# EAGLE schematic lightSource (EAGLE 9.1.2)

## Sheet 1 of 3
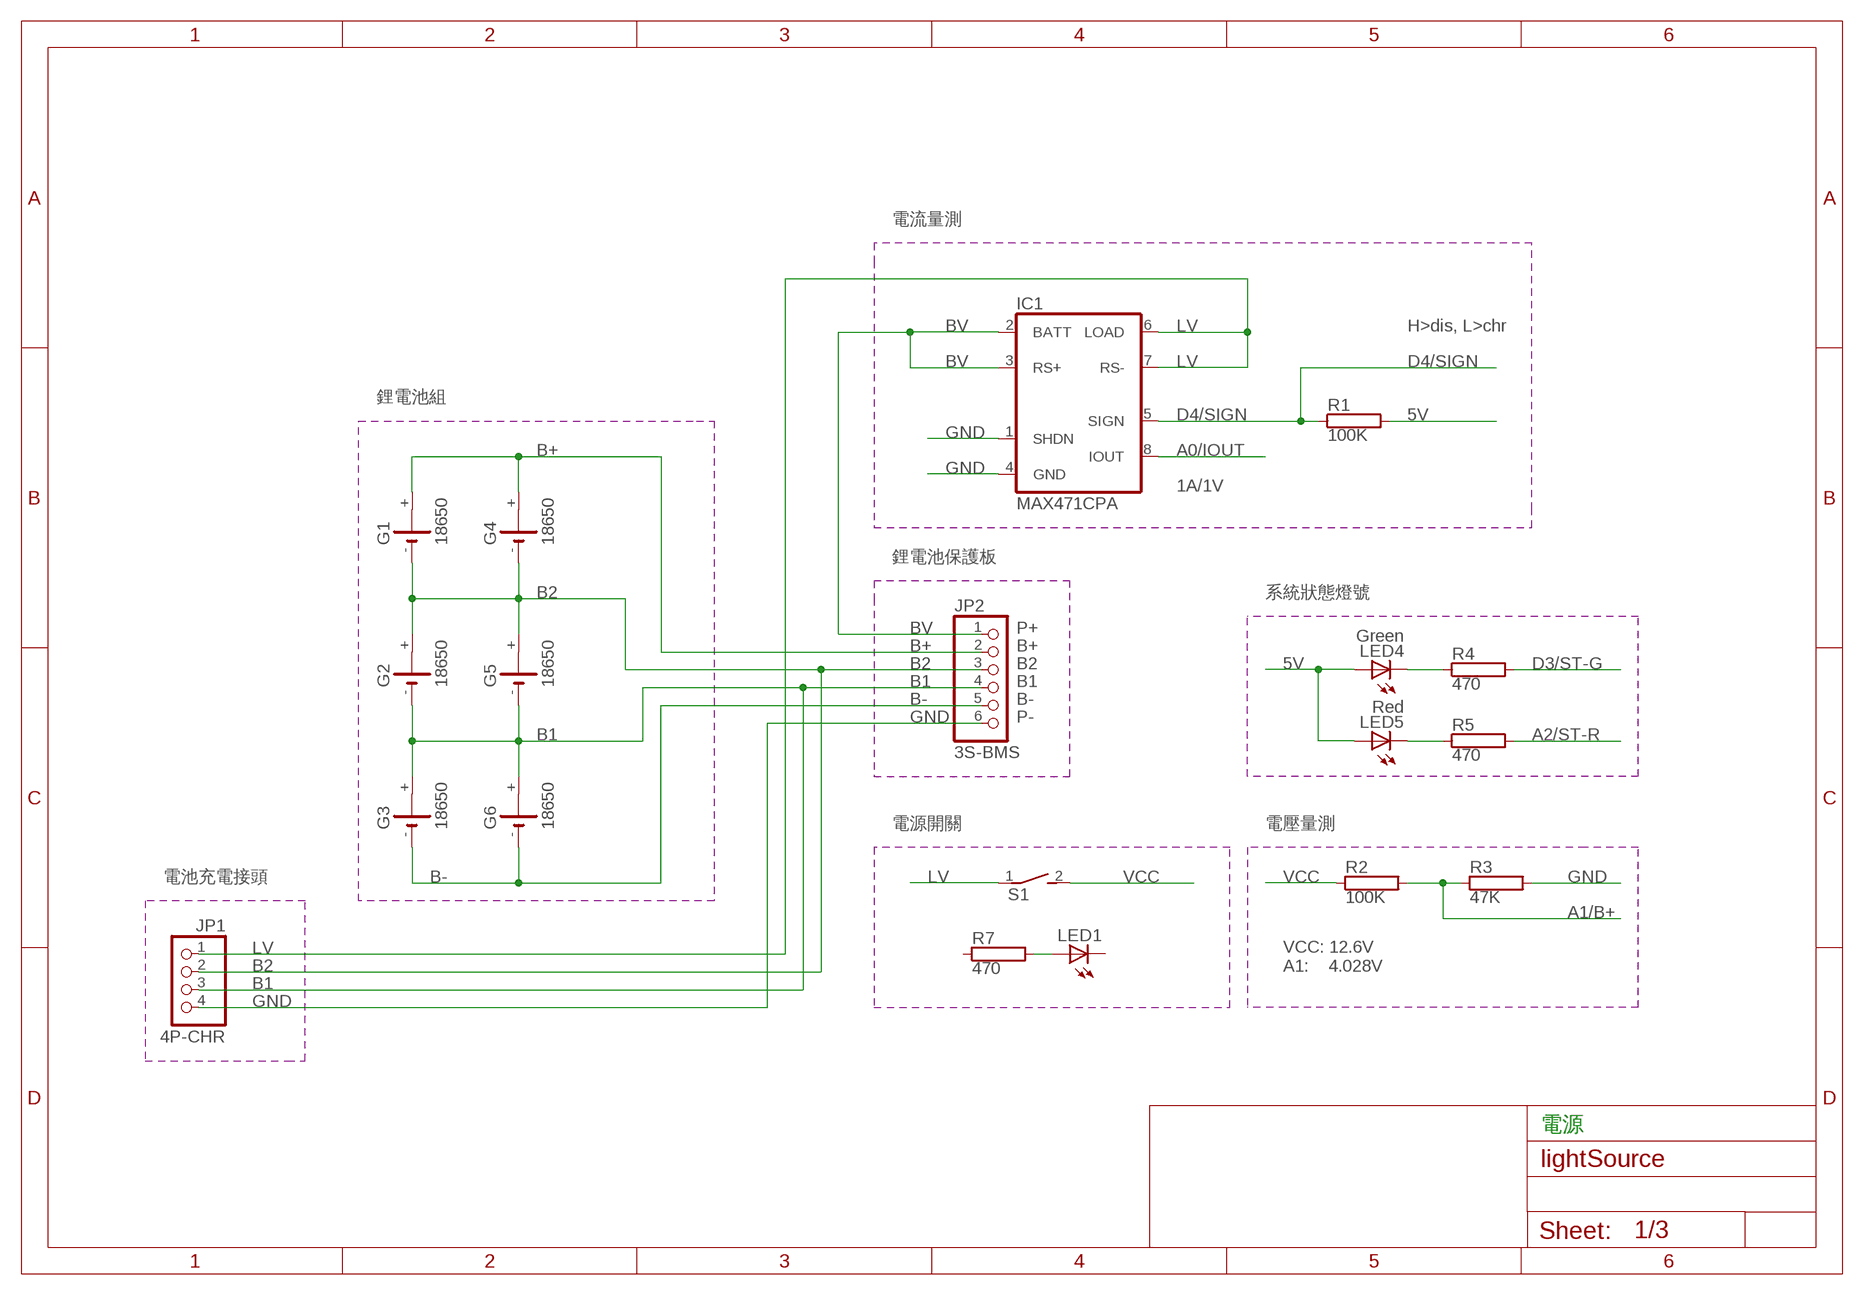
[diagram p0: schematic, sheet 1]

### Parts
G1  18650  CRAA  [CRAA]
G2  18650  CRAA  [CRAA]
G3  18650  CRAA  [CRAA]
G4  18650  CRAA  [CRAA]
G5  18650  CRAA  [CRAA]
G6  18650  CRAA  [CRAA]
IC1  MAX471CPA  [DIL08]
JP1  4P-CHR  PINHD-1X4  [1X04]
JP2  3S-BMS  PINHD-1X6  [1X06]
LED1  LED5MM  [LED5MM]
LED4  Green  LED5MM  [LED5MM]
LED5  Red  LED5MM  [LED5MM]
R1  100K  RRS1/4  [RS1/4]
R2  100K  RRS1/4  [RS1/4]
R3  47K  RRS1/4  [RS1/4]
R4  470  RRS1/4  [RS1/4]
R5  470  RRS1/4  [RS1/4]
R7  470  RRS1/4  [RS1/4]
S1  DS01E  [DS-01]

### Nets
5V: LED4.A LED5.A R1.2 ; also sheet 2
A0/IOUT: IC1.8(IOUT) ; also sheet 2
A1/B+: R2.2 R3.1 ; also sheet 2
A2/ST-R: R5.2 ; also sheet 2
B1: G2.- G3.+ G5.- G6.+ JP1.3 JP2.4
B2: G1.- G2.+ G4.- G5.+ JP1.2 JP2.3
B+: G1.+ G4.+ JP2.2
B-: G3.- G6.- JP2.5
BV: IC1.2(BATT) IC1.3(RS+) JP2.1
D3/ST-G: R4.2 ; also sheet 2
D4/SIGN: IC1.5(SIGN) R1.1 ; also sheet 2
GND: IC1.1(SHDN) IC1.4(GND) JP1.4 JP2.6 R3.2 ; also sheet 2,3
LV: IC1.6(LOAD) IC1.7(RS-) JP1.1 S1.1
N$1: LED1.A R7.2
N$5: LED4.K(C) R4.1
N$6: LED5.K(C) R5.1
VCC: R2.1 S1.2 ; also sheet 2,3
Unconnected: G1.+@1(+) G2.+@1(+) G3.+@1(+) G4.+@1(+) G5.+@1(+) G6.+@1(+) LED1.K(C) R7.1

### Notes on the sheet
- 電流量測
- H>dis, L>chr
- 鋰電池組
- 1A/1V
- 鋰電池保護板
- 系統狀態燈號
- P+
- B+
- B2
- B1
- B-
- P-
- 電源開關 | 電壓量測
- 電池充電接頭
- VCC: 12.6V
  A1:    4.028V
- 電源

## Sheet 2 of 3
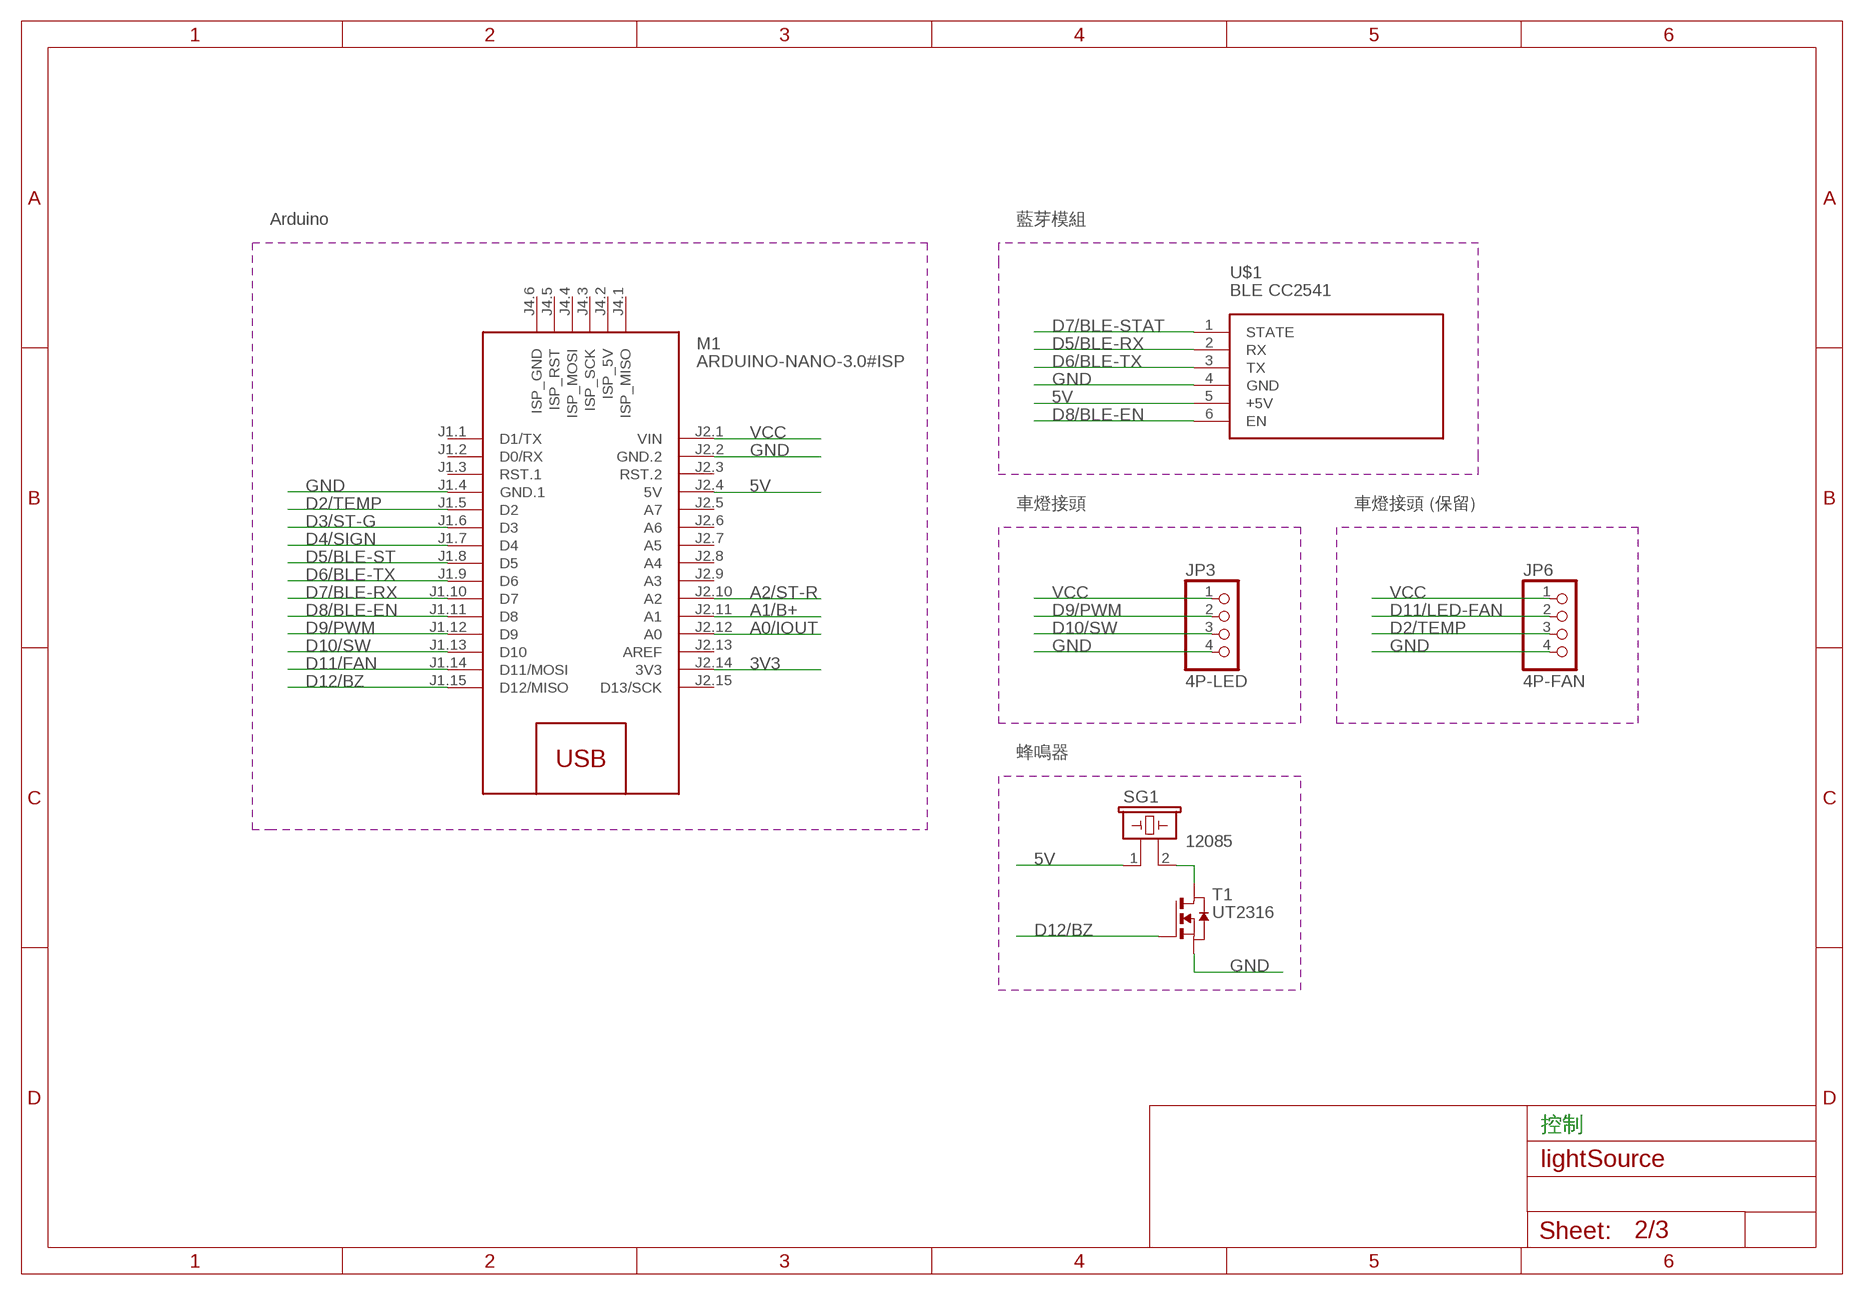
[diagram p1: schematic, sheet 2]

### Parts
JP3  4P-LED  PINHD-1X4  [1X04]
JP6  4P-FAN  PINHD-1X4  [1X04]
M1  ARDUINO-NANO-3.0#ISP  [ARDUINO-NANO-3.0#ISP]
SG1  12085  B/C11S  [B/C11S]
T1  UT2316  NMOSSOT23  [SOT-23]
U$1  BLE CC2541  WIRELESS-BLUETOOTH-HC-05  [WIRELESS-BLUETOOTH-HC-05]

### Nets
3V3: M1.J2.14(3V3)
5V: M1.J2.4(5V) SG1.1 U$1.5(+5V) ; also sheet 1
A0/IOUT: M1.J2.12(A0) ; also sheet 1
A1/B+: M1.J2.11(A1) ; also sheet 1
A2/ST-R: M1.J2.10(A2) ; also sheet 1
D2/TEMP: JP6.3 M1.J1.5(D2)
D3/ST-G: M1.J1.6(D3) ; also sheet 1
D4/SIGN: M1.J1.7(D4) ; also sheet 1
D5/BLE-RX: U$1.2(RX)
D5/BLE-ST: M1.J1.8(D5)
D6/BLE-TX: M1.J1.9(D6) U$1.3(TX)
D7/BLE-RX: M1.J1.10(D7)
D7/BLE-STAT: U$1.1(STATE)
D8/BLE-EN: M1.J1.11(D8) U$1.6(EN)
D9/PWM: JP3.2 M1.J1.12(D9) ; also sheet 3
D10/SW: JP3.3 M1.J1.13(D10) ; also sheet 3
D11/FAN: M1.J1.14(D11/MOSI)
D11/LED-FAN: JP6.2
D12/BZ: M1.J1.15(D12/MISO) T1.3(G)
GND: JP3.4 JP6.4 M1.J1.4(GND.1) M1.J2.2(GND.2) T1.2(S) U$1.4(GND) ; also sheet 1,3
N$4: SG1.2 T1.1(D)
VCC: JP3.1 JP6.1 M1.J2.1(VIN) ; also sheet 1,3
Unconnected: M1.J1.1(D1/TX) M1.J1.2(D0/RX) M1.J1.3(RST.1) M1.J2.3(RST.2) M1.J2.5(A7) M1.J2.6(A6) M1.J2.7(A5) M1.J2.8(A4) M1.J2.9(A3) M1.J2.13(AREF) M1.J2.15(D13/SCK) M1.J4.1(ISP_MISO) M1.J4.2(ISP_5V) M1.J4.3(ISP_SCK) M1.J4.4(ISP_MOSI) M1.J4.5(ISP_RST) M1.J4.6(ISP_GND)

### Notes on the sheet
- Arduino | 藍芽模組
- 車燈接頭 | 車燈接頭 (保留)
- 蜂鳴器
- 控制

## Sheet 3 of 3
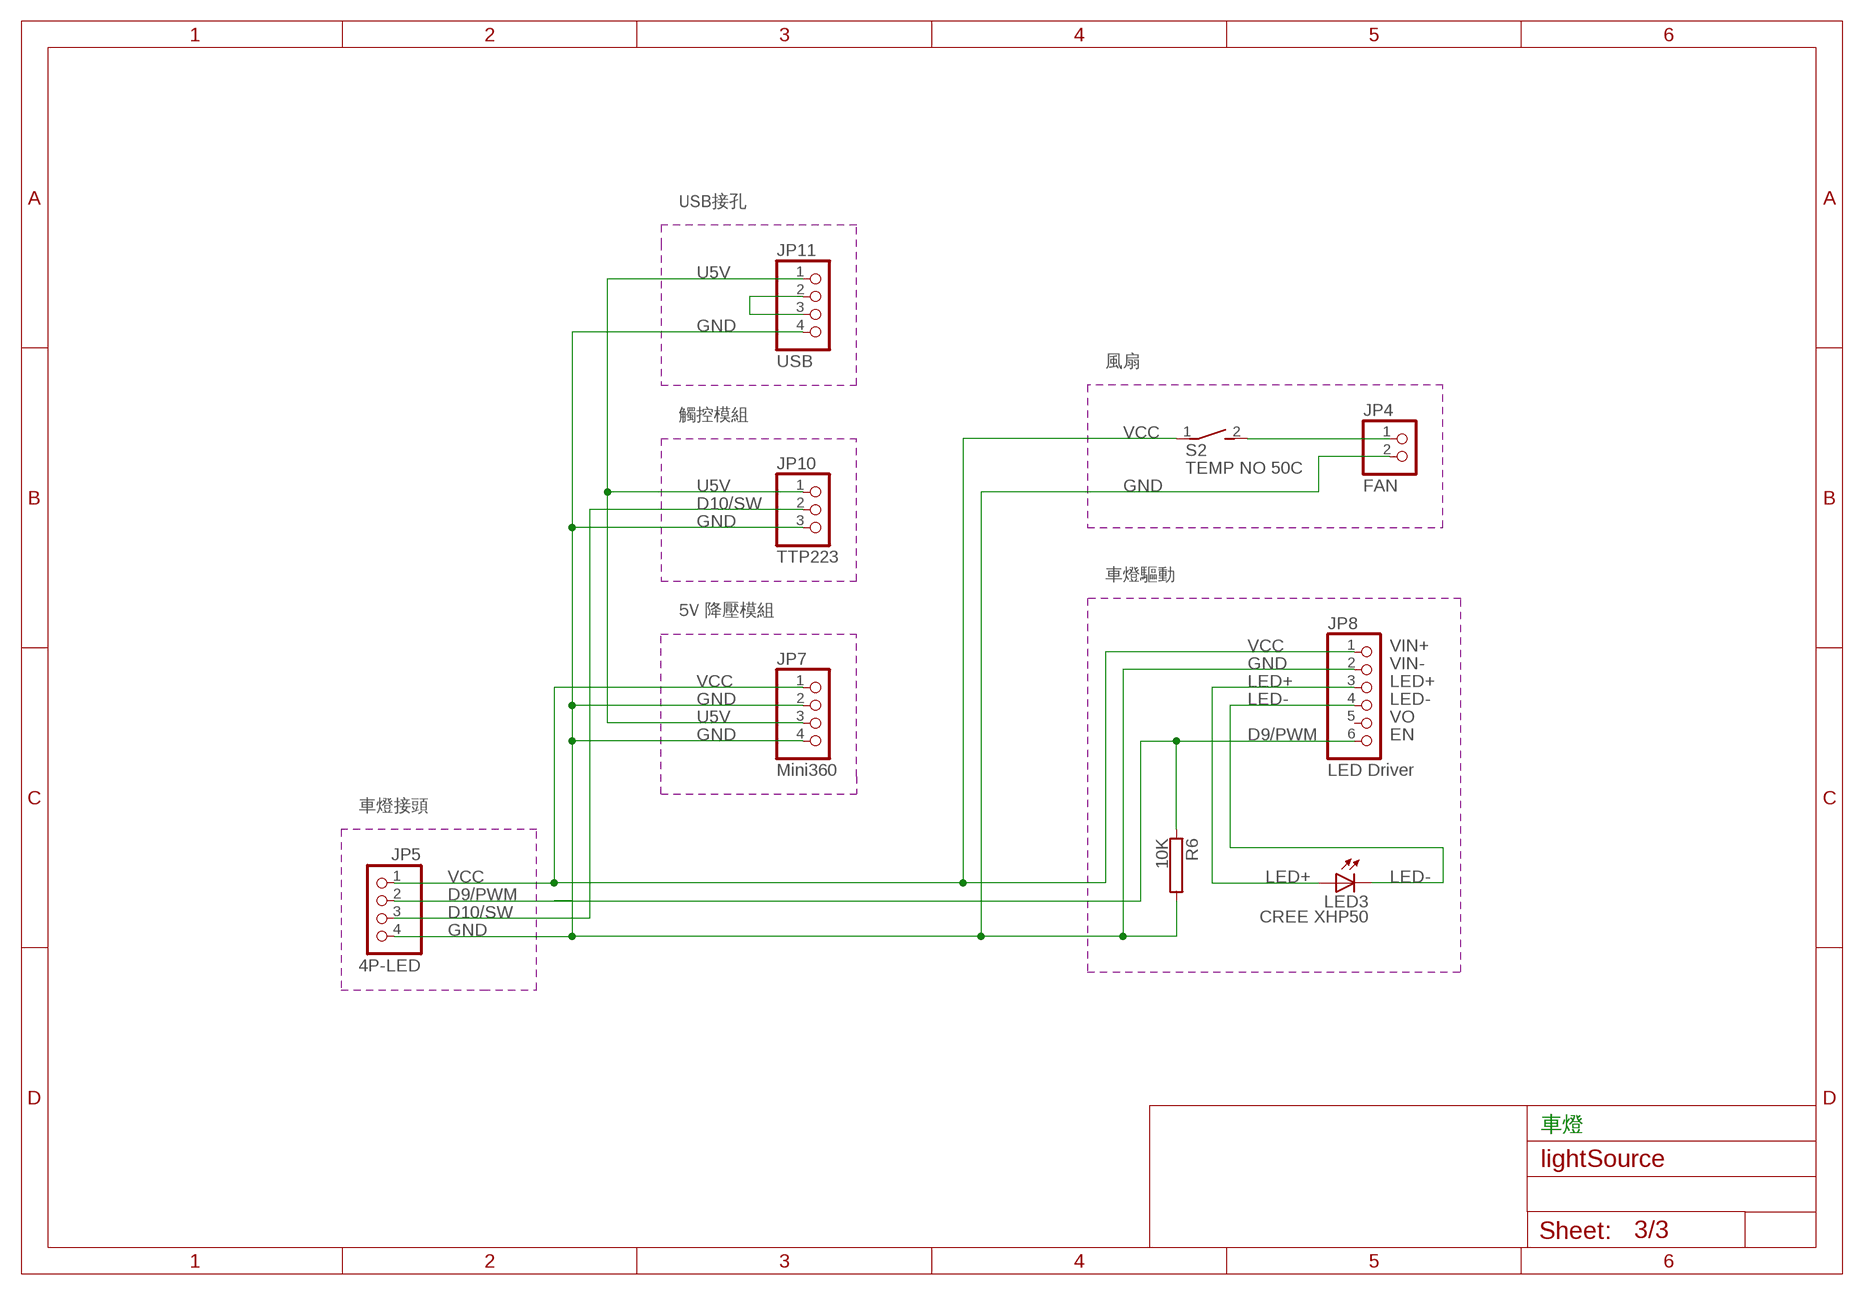
[diagram p2: schematic, sheet 3]

### Parts
JP4  FAN  PINHD-1X2  [1X02]
JP5  4P-LED  PINHD-1X4  [1X04]
JP7  Mini360  PINHD-1X4  [1X04]
JP8  LED Driver  PINHD-1X6  [1X06]
JP10  TTP223  PINHD-1X3  [1X03]
JP11  USB  PINHD-1X4  [1X04]
LED3  CREE XHP50  LED5MM  [LED5MM]
R6  10K  RRS1/4  [RS1/4]
S2  TEMP NO 50C  DS01E  [DS-01]

### Nets
D9/PWM: JP5.2 JP8.6 R6.1 ; also sheet 2
D10/SW: JP5.3 JP10.2 ; also sheet 2
GND: JP4.2 JP5.4 JP7.2 JP7.4 JP8.2 JP10.3 JP11.4 R6.2 ; also sheet 1,2
LED+: JP8.3 LED3.A
LED-: JP8.4 LED3.K(C)
N$2: JP11.2 JP11.3
N$3: JP4.1 S2.2
U5V: JP7.3 JP10.1 JP11.1
VCC: JP5.1 JP7.1 JP8.1 S2.1 ; also sheet 1,2
Unconnected: JP8.5

### Notes on the sheet
- USB接孔
- 風扇
- 觸控模組
- 車燈驅動
- 5V 降壓模組
- VIN+
- VIN-
- LED+
- LED-
- VO
- EN
- 車燈接頭
- 車燈

## Library data of the parts
G1-G6 = battery:CRAA: LI BATTERY Varta
IC1 = maxim:MAX471CPA: OP AMP
JP1 JP3 JP5-JP7 JP11 = pinhead:PINHD-1X4: PIN HEADER
JP2 JP8 = pinhead:PINHD-1X6: PIN HEADER
JP4 = pinhead:PINHD-1X2: PIN HEADER
JP10 = pinhead:PINHD-1X3: PIN HEADER
LED1 LED3-LED5 = led:LED: LED OSRAM: - CHIPLED LG R971, LG N971, LY N971, LG Q971, LY Q971, LO R971, LY R971 LH N974, LH R974 LS Q976, LO Q976, LY Q976 LO Q996 - Hyper CHIPLED LW Q18S LB Q993, LB Q99A, LB R99A - SideLED LS A670, LO A670, LY A670, LG A670, LP A670 LB A673, LV A673, LT A673, LW A673 LH A674 LY A675 LS A676, LA A676, LO A676, LY A676, LW A676 LS A679, LY A679, LG A679 - Hyper Micro SIDELED® LS Y876, LA Y876, LO Y876, LY Y876 LT Y87S - SmartLED LW L88C, LW L88S LB L89C, LB L89S, LG L890 LS L89K, LO L89K, LY L89K LS L896, LA L896, LO L896, LY L896 - TOPLED LS T670, LO T670, LY T670, LG T670, LP T670 LSG T670, LSP T670, LSY T670, LOP T670, LYG T670 LG T671, LOG T671, LSG T671 LB T673, LV T673, LT T673, LW T673 LH T674 LS T676, LA T676, LO T676, LY T676, LB T676, LH T676, LSB T676, LW T676 LB T67C, LV T67C, LT T67C, LS T67K, LO T67K, LY T67K, LW E67C LS E67B, LA E67B, LO E67B, LY E67B, LB E67C, LV E67C, LT E67C LW T67C LS T679, LY T679, LG T679 LS T770, LO T770, LY T770, LG T770, LP T770 LB T773, LV T773, LT T773, LW T773 LH T774 LS E675, LA E675, LY E675, LS T675 LS T776, LA T776, LO T776, LY T776, LB T776 LHGB T686 LT T68C, LB T68C - Hyper Mini TOPLED® LB M676 - Mini TOPLED Santana® LG M470 LS M47K, LO M47K, LY M47K Source: http://www.osram.convergy.de LUXEON: - LUMILED® LXK2-PW12-R00, LXK2-PW12-S00, LXK2-PW14-U00, LXK2-PW14-V00 LXK2-PM12-R00, LXK2-PM12-S00, LXK2-PM14-U00 LXK2-PE12-Q00, LXK2-PE12-R00, LXK2-PE12-S00, LXK2-PE14-T00, LXK2-PE14-U00 LXK2-PB12-K00, LXK2-PB12-L00, LXK2-PB12-M00, LXK2-PB14-N00, LXK2-PB14-P00, LXK2-PB14-Q00 LXK2-PR12-L00, LXK2-PR12-M00, LXK2-PR14-Q00, LXK2-PR14-R00 LXK2-PD12-Q00, LXK2-PD12-R00, LXK2-PD12-S00 LXK2-PH12-R00, LXK2-PH12-S00 LXK2-PL12-P00, LXK2-PL12-Q00, LXK2-PL12-R00 Source: www.luxeon.com KINGBRIGHT: KA-3528ASYC Source: www.kingbright.com
M1 = diy-modules:ARDUINO-NANO-3.0#ISP: Arduino Nano 3.0 (and compatible devices) with ISP pads More details available here: https://www.arduino.cc/en/Main/ArduinoBoardNano Click here to find device on ebay.com <http://www.ebay.com/sch/arduino+nano>
R1-R7 = resistor-power:R: Power Resitor; MF: OHMITE; MPN: RRS1K0; OC_FARNELL: unknown; OC_NEWARK: 01F7661
S1 S2 = switch-dil:DS01E: DIL/CODE SWITCH; OC_FARNELL: unknown; OC_NEWARK: unknown
SG1 = buzzer:B/C11S: BUZZER Source: Buerklin; OC_FARNELL: unknown; OC_NEWARK: unknown
T1 = zetex:NMOSSOT23: MOS FET; OC_FARNELL: unknown; OC_NEWARK: unknown
U$1 = diy-modules:WIRELESS-BLUETOOTH-HC-05: Bluetooth Transceiver Module based on HC-05 board Tutorial is available here: https://arduino-info.wikispaces.com/BlueTooth-HC05-HC06-Modules-How-To Click here to find device on ebay.com <http://www.ebay.com/sch/hc-05+module+rs232>